# EAGLE schematic ll_start (EAGLE 8.1.0)
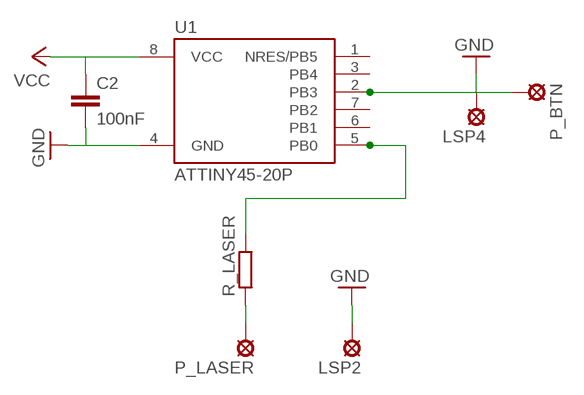
[diagram p0: schematic, sheet 1]

## Parts
C2  100nF  C-EU025-025X050  [C025-025X050]
LSP2  LSP10  [LSP10]
LSP4  LSP10  [LSP10]
P_BTN  LSP10  [LSP10]
P_LASER  LSP10  [LSP10]
R_LASER  R-EU_0204/7  [0204/7]
U1  ATTINY45-20P  [PDIP08_300MIL]

## Nets
GND: C2.2 LSP2.MP LSP4.MP U1.4(GND)
MOSI: R_LASER.2 U1.5(PB0)
N$4: P_LASER.MP R_LASER.1
N$8: P_BTN.MP U1.2(PB3)
VCC: C2.1 U1.8(VCC)
Unconnected: U1.1(NRES/PB5) U1.3(PB4) U1.6(PB1) U1.7(PB2)

## Library data of the parts
C2 = rcl:C-EU: CAPACITOR, European symbol
LSP2 LSP4 P_BTN P_LASER = solpad:LSP10: SOLDER PAD drill 1.0 mm, distributor Buerklin, 12H555
R_LASER = rcl:R-EU_: RESISTOR, European symbol
U1 = attiny25_45_85:ATTINY45*: ATMEL ATtiny 45 Packages: P = PDIP 08 30mil S = SOIC 08 EIAJ 208mil X = TSSOP 08 4.4mm Technologies Note: for complete ordering code (temp. range, finish, tape&reel etc.) see www.atmel.com • Supply Voltage: V = (1.8…5.5)V | [blank] = (2.7…5.5)V • Speed: 10 = 10 MHz | 20 = 20 MHz Author: Dipl.-Ing. FH Rainer Bayer HHN Hochschule Heilbronn (Heilbronn University), rainer.bayer@hs-heilbronn.de Ingenieurbüro ing-rb, mail@ing-rb.de